# EasyEDA Pro project Adorkable_EXP.eprj, schematic Schematic1

## Sheets
1 RK809-5: Board Name: Board1; Create Date: 2024-12-09; Page Name: RK809-5; Project Name: Adorkable_EXP; Schematic Name: Schematic1; Update Date: 2024-12-10; Company: 嘉立创EDA; Page Size: A4; Version: V1.0
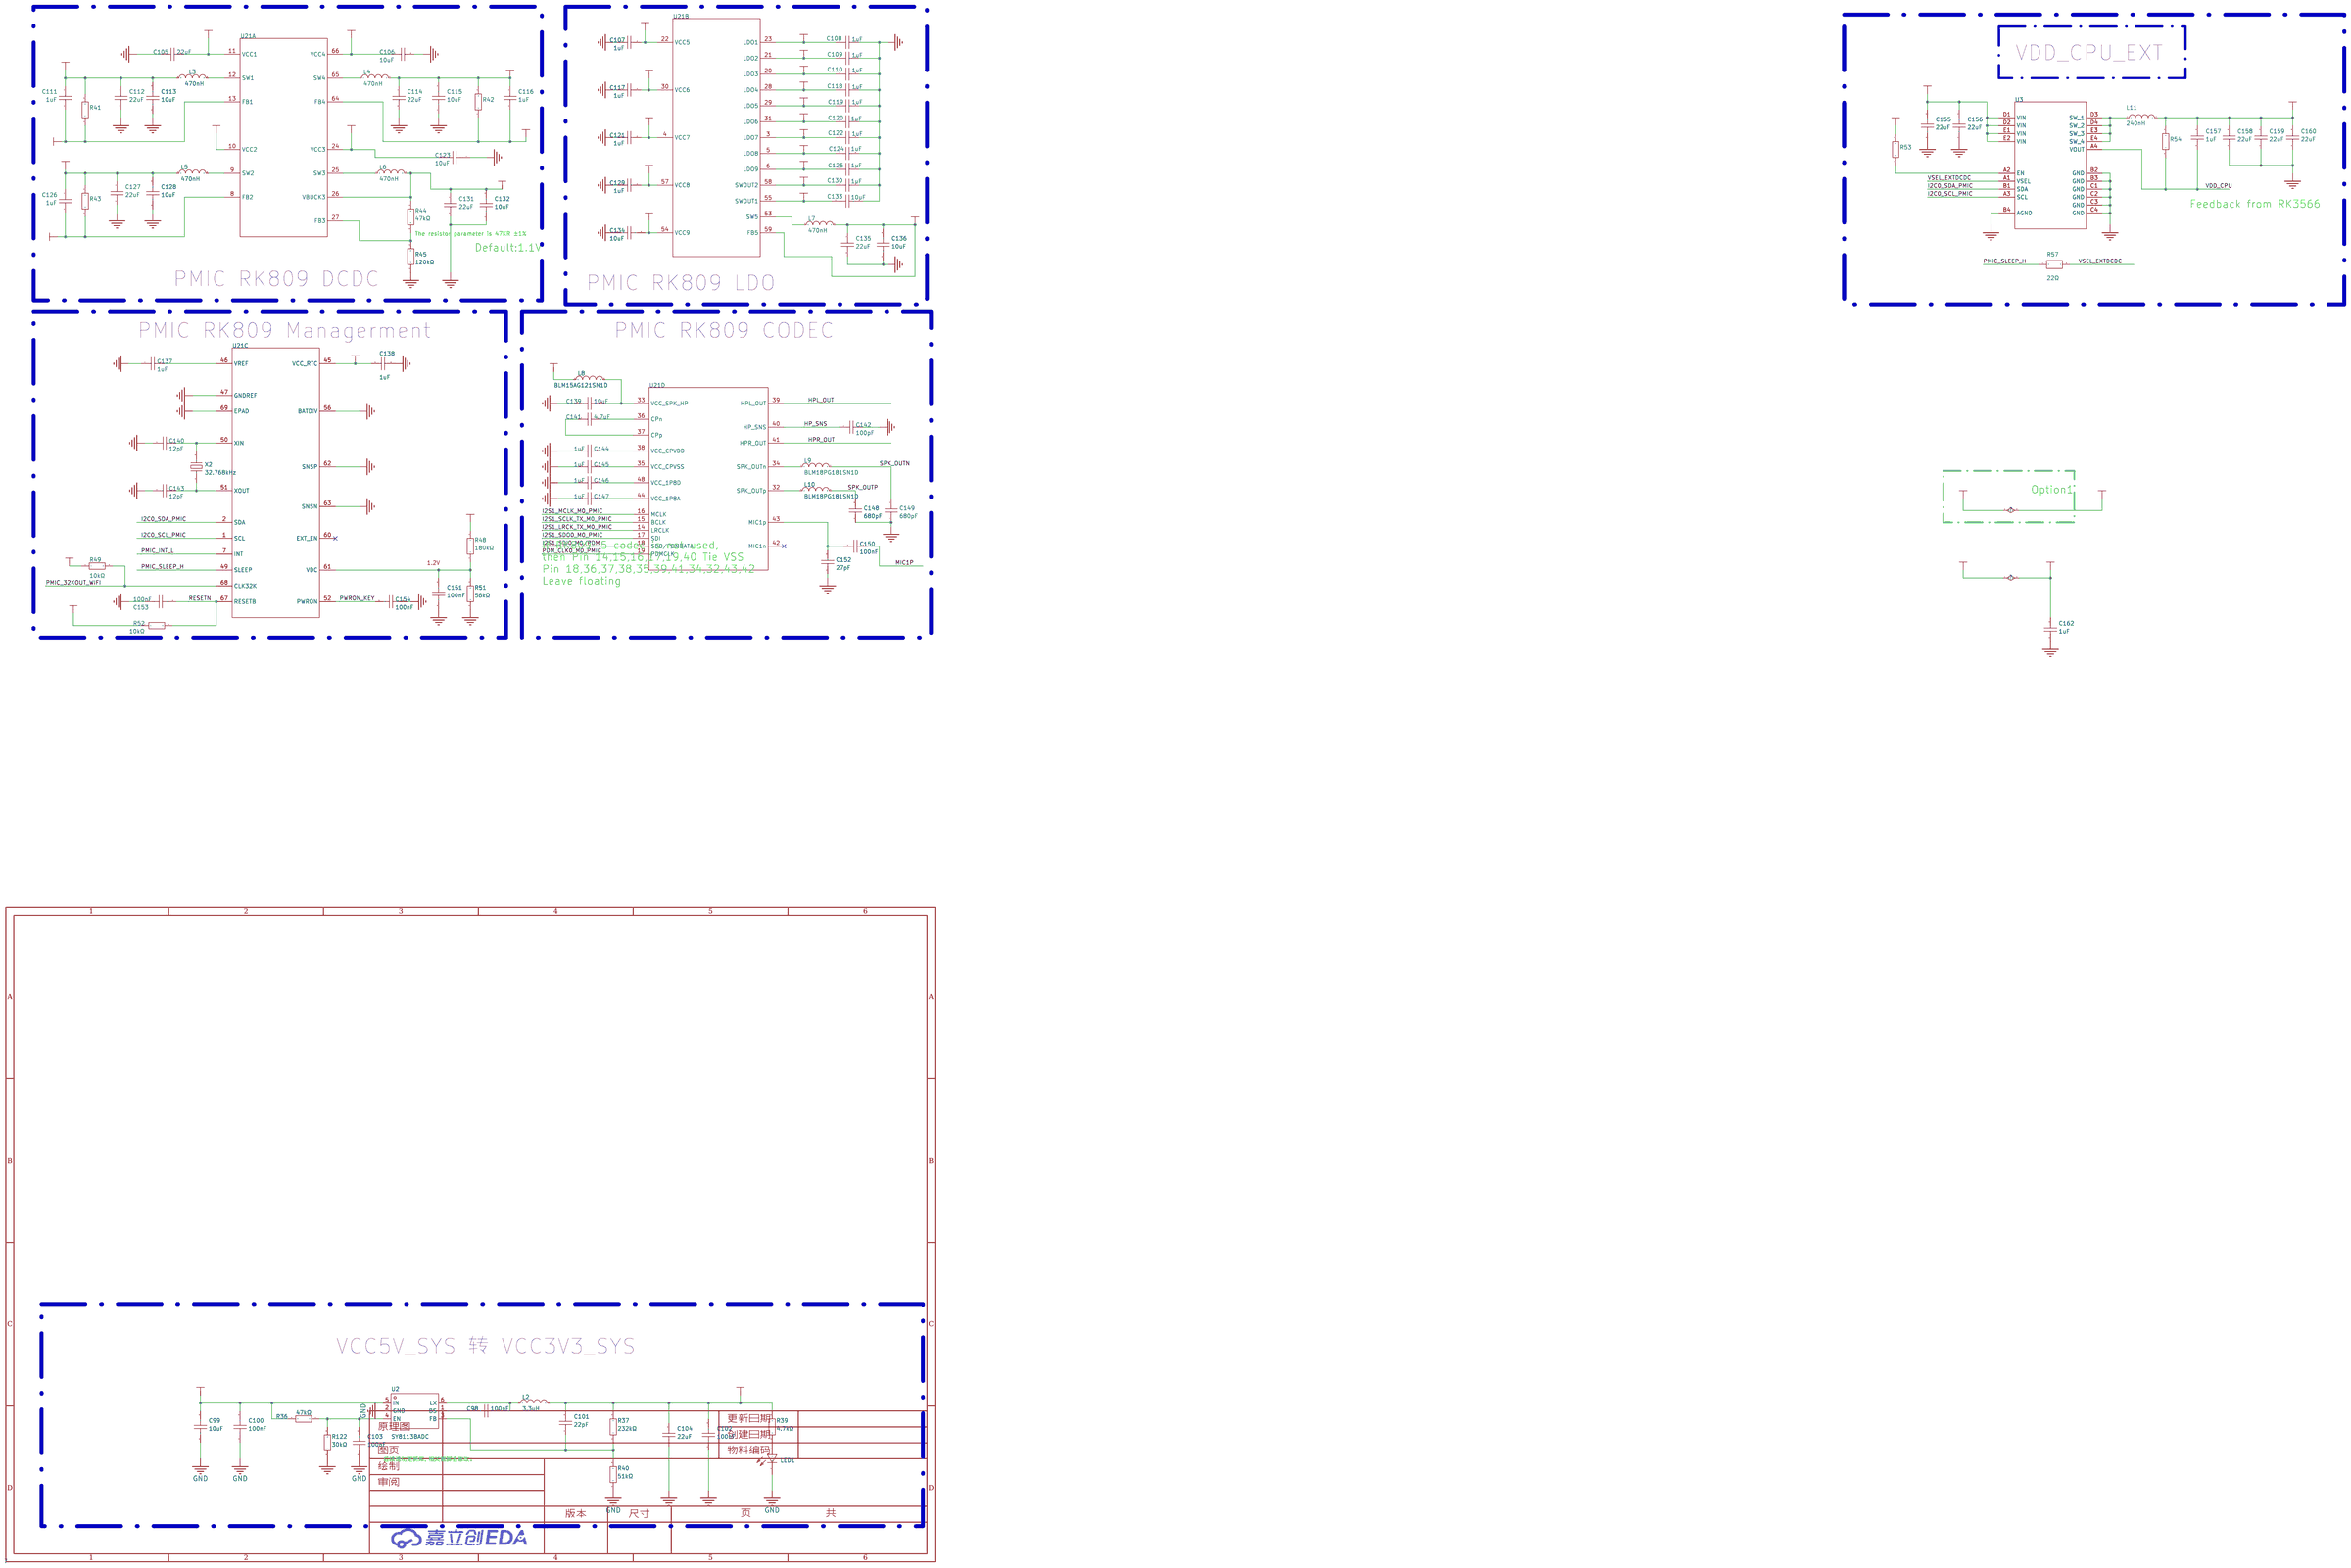
[diagram p0: RK809-5]
2 AP6212: Page Name: AP6212; Project Name: MiniTV_Plus_PWR_WiFi; Update Date: 2024-12-09
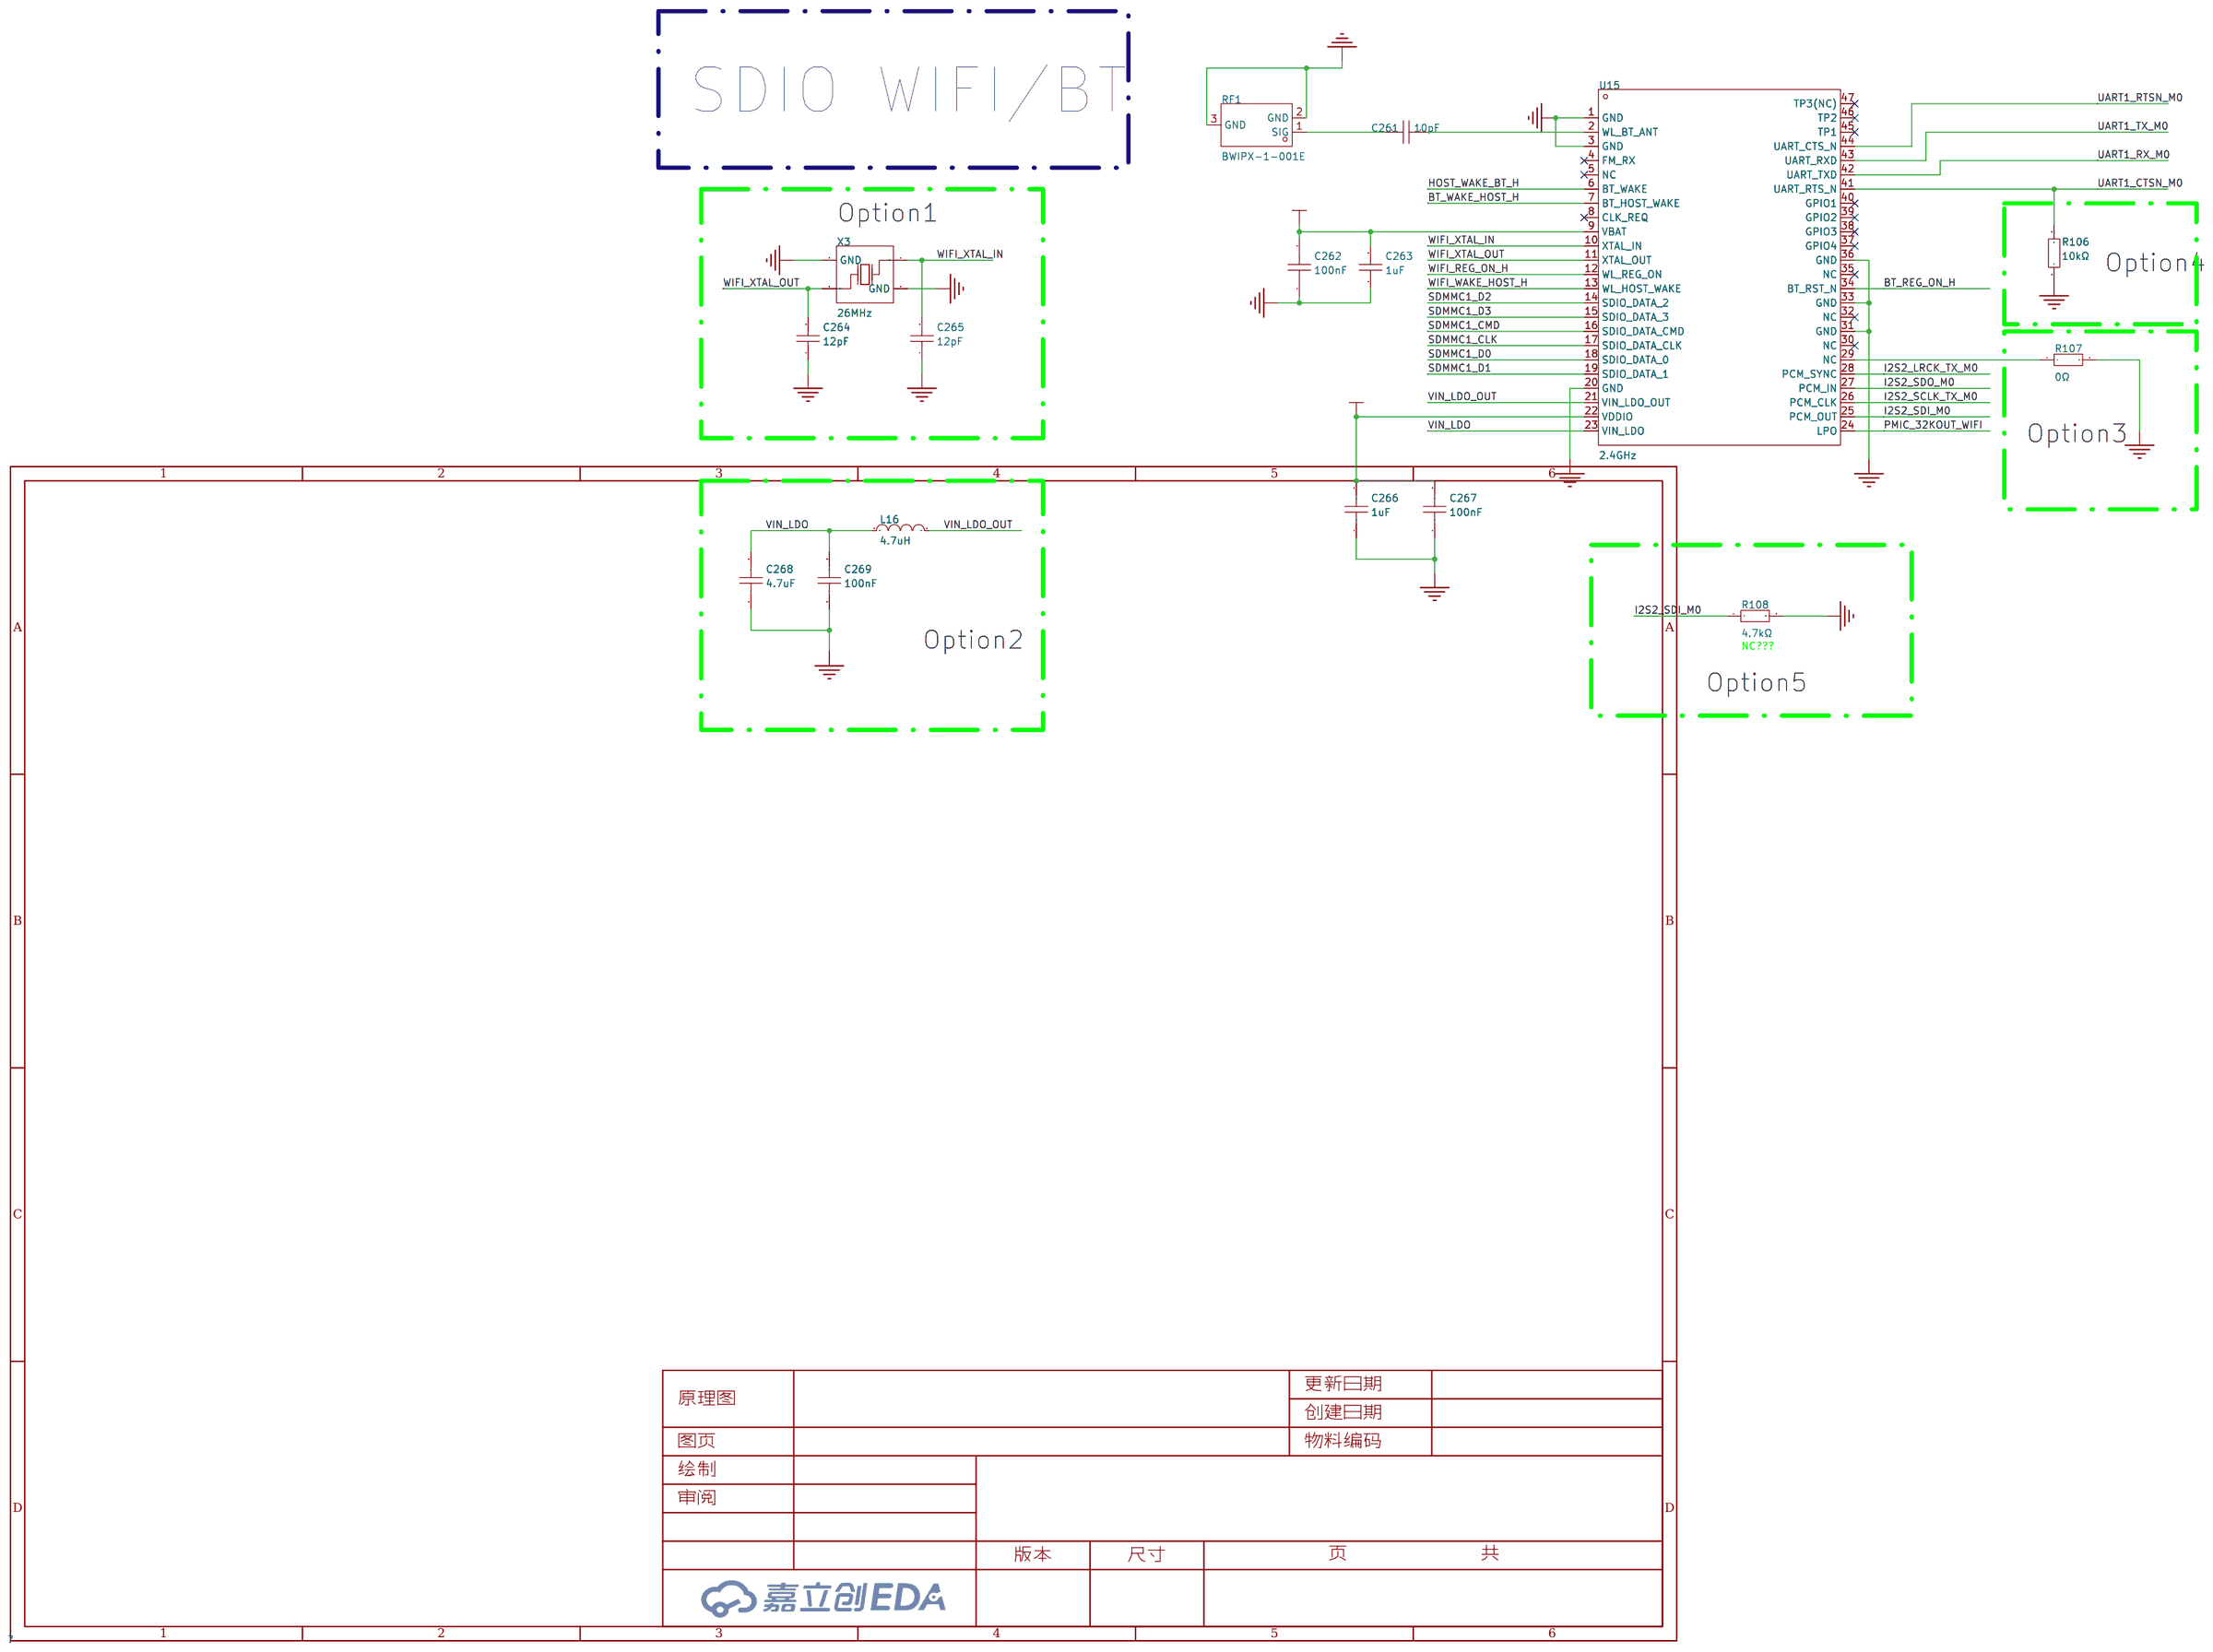
[diagram p1: AP6212]
3 EMMC: Page Name: EMMC; Project Name: MiniTV_Plus_PWR_WiFi
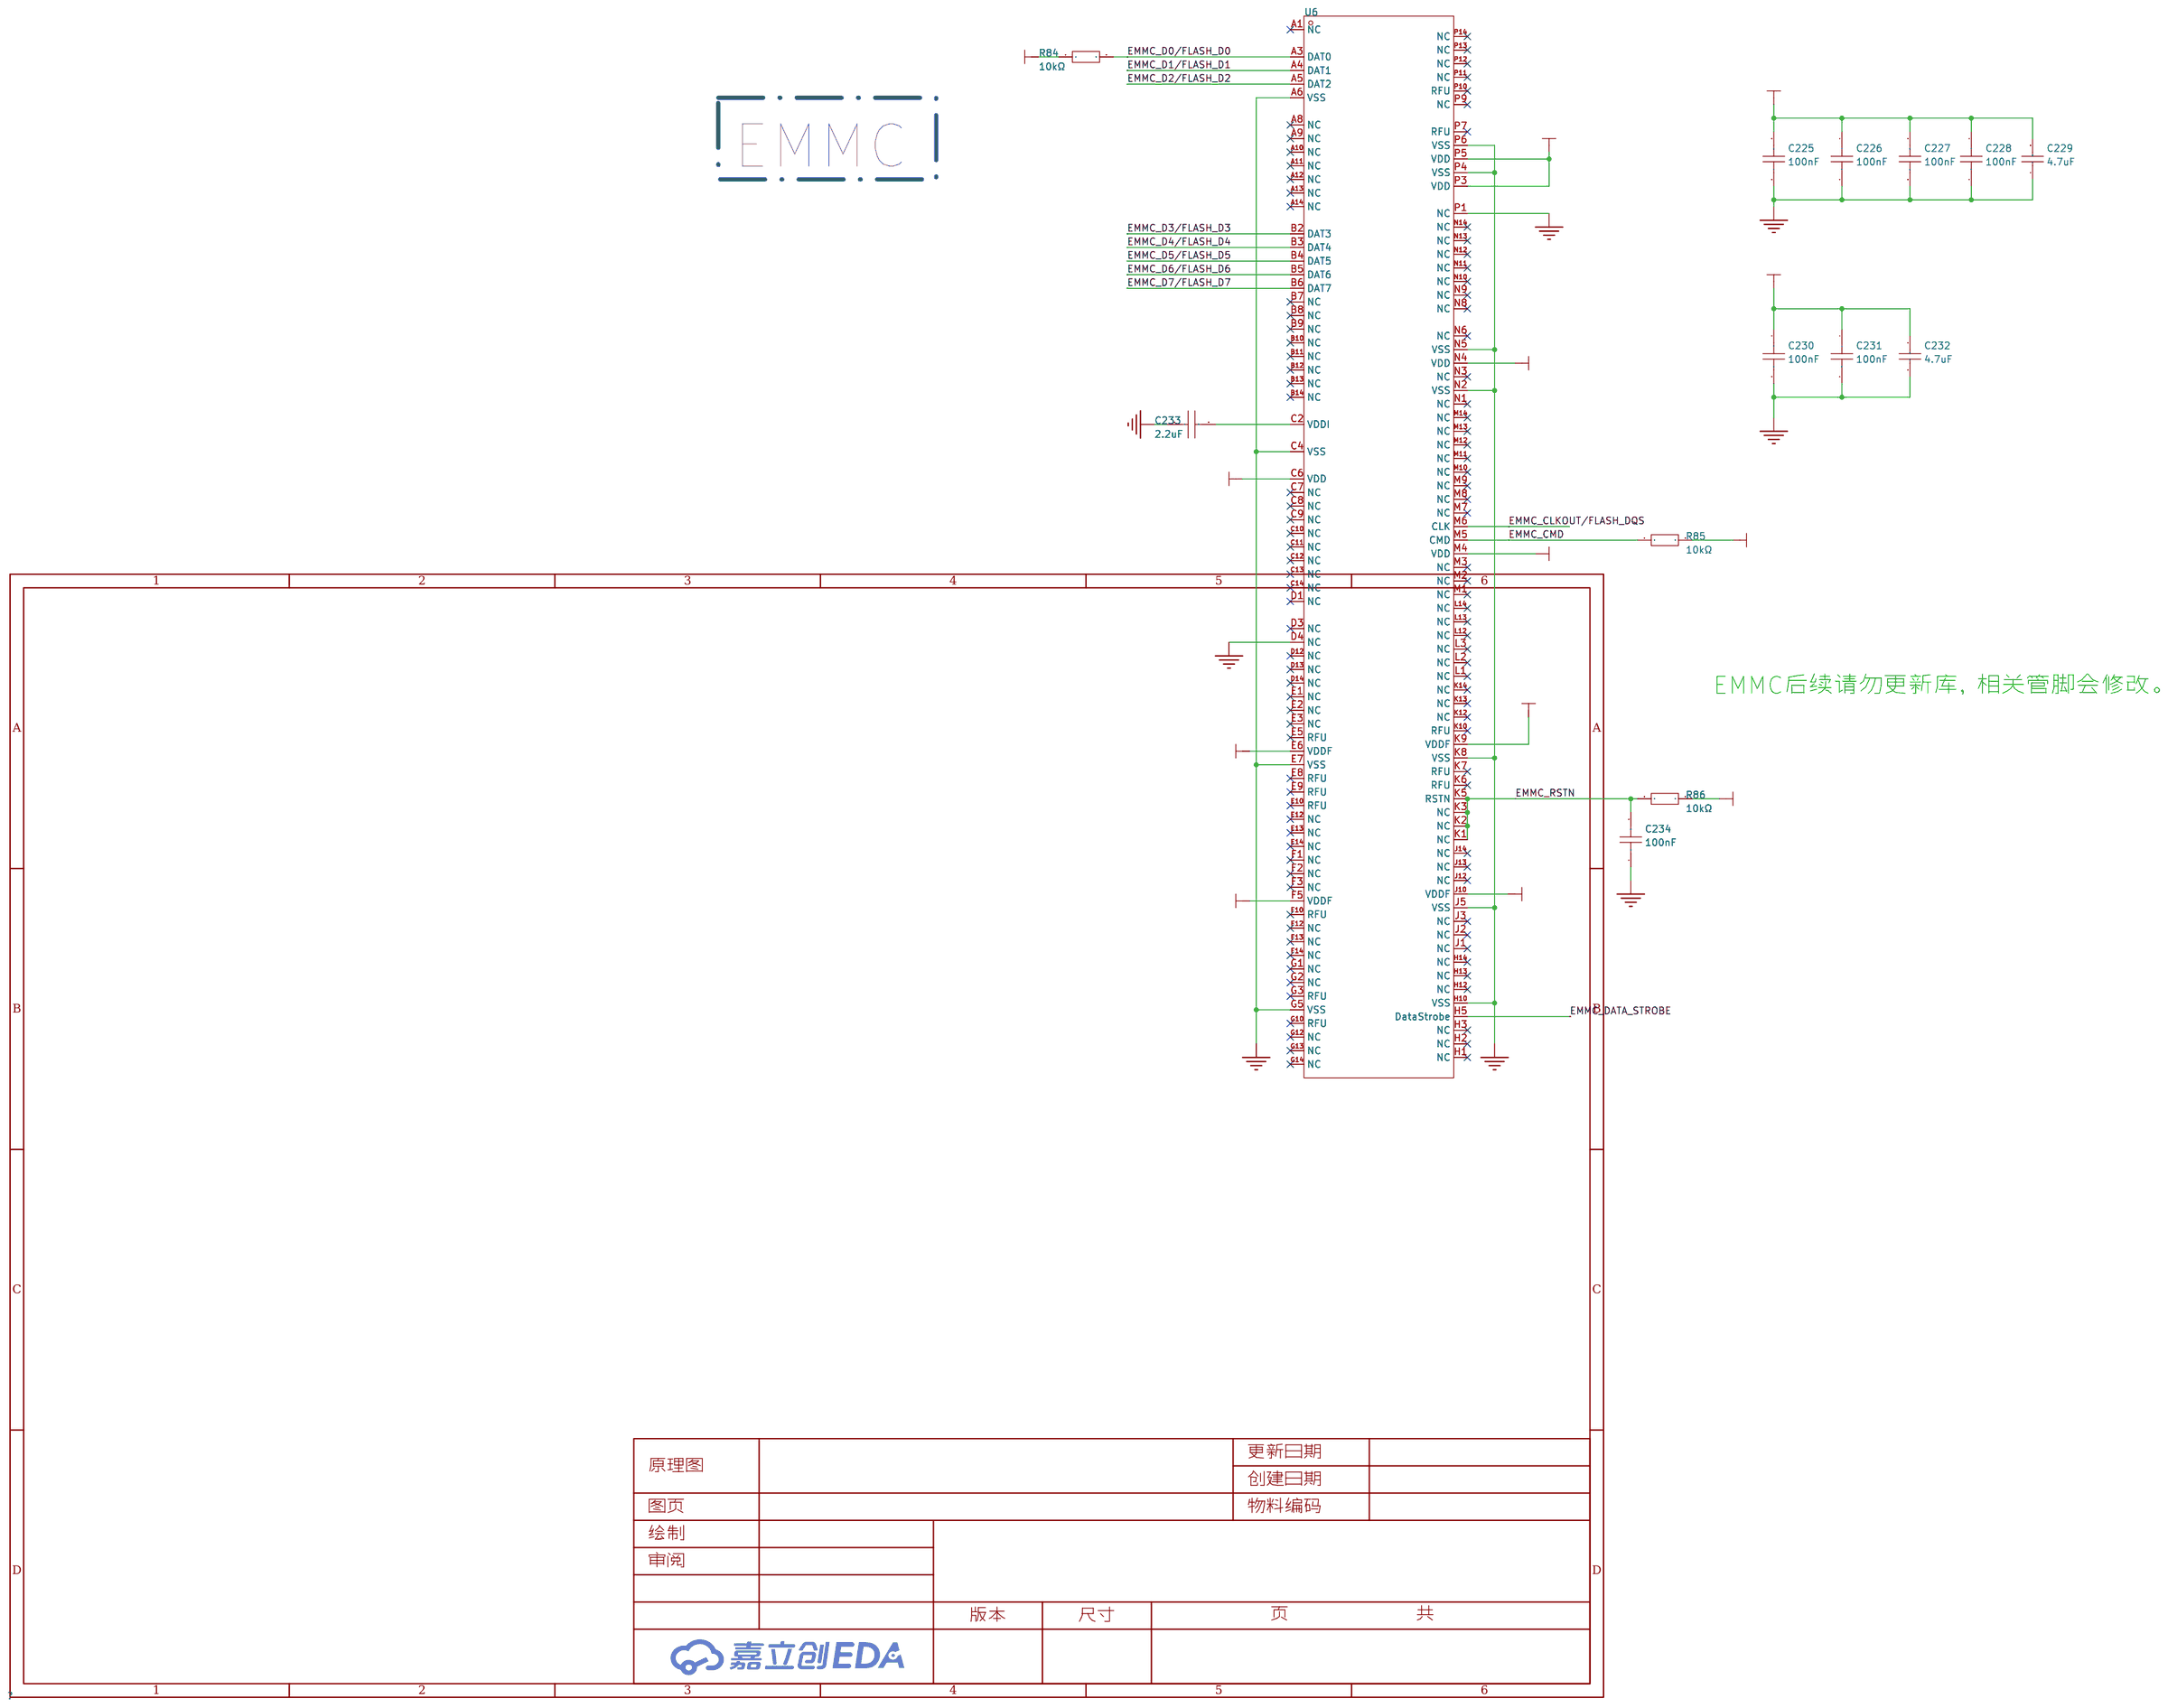
[diagram p2: EMMC]

## Parts
sheet AP6212
C261  10pF  [C0402]
C262  100nF  [R0603]
C263  1uF  [R0603]
C264  12pF  [C0603]
C265  12pF  [C0603]
C266  1uF  [R0402]
C267  100nF  [R0603]
C268  4.7uF  [R0402]
C269  100nF  [R0603]
L16  4.7uH  [L1008]
R106  10kΩ  [R0402]
R107  0Ω  [R0402]
R108  4.7kΩ  [R0402]
RF1  BWIPX-1-001E  [IPEX-SMD_BWIPX-1-001E]
U15  2.4GHz  [QFN-44_L12.0-W12.0-P0.90-TL_AP6212]
X3  26MHz  [CRYSTAL-SMD_4P-L2.0-W1.6-BL]
sheet EMMC
C225  100nF  [R0402]
C226  100nF  [R0402]
C227  100nF  [R0402]
C228  100nF  [R0402]
C229  4.7uF  [R0402]
C230  100nF  [R0402]
C231  100nF  [R0402]
C232  4.7uF  [R0402]
C233  2.2uF  [R0402]
C234  100nF  [R0402]
R84  10kΩ  [R0402]
R85  10kΩ  [R0402]
R86  10kΩ  [R0402]
U6  SDINBDG4-8G  [FBGA-153_L13.0-W11.5-P0.50_KLMAG1JETD-B041]
sheet RK809-5
C98  100nF  [R0402]
C99  10uF  [C0603]
C100  100nF  [R0603]
C101  22pF  [R0402]
C102  100nF  [R0603]
C103  100nF  [R0402]
C104  22uF  [C0603]
C105  22uF  [C0603]
C106  10uF  [R0402]
C107  1uF  [R0402]
C108  1uF  [R0402]
C109  1uF  [R0402]
C110  1uF  [R0402]
C111  1uF  [R0402]
C112  22uF  [C0603]
C113  10uF  [C0603]
C114  22uF  [C0603]
C115  10uF  [C0603]
C116  1uF  [R0402]
C117  1uF  [R0402]
C118  1uF  [R0402]
C119  1uF  [R0402]
C120  1uF  [R0402]
C121  1uF  [R0402]
C122  1uF  [R0402]
C123  10uF  [C0603]
C124  1uF  [R0402]
C125  1uF  [R0402]
C126  1uF  [R0402]
C127  22uF  [C0603]
C128  10uF  [C0603]
C129  1uF  [R0402]
C130  1uF  [R0402]
C131  22uF  [C0603]
C132  10uF  [C0603]
C133  10uF  [C0603]
C134  10uF  [C0603]
C135  22uF  [C0603]
C136  10uF  [C0603]
C137  1uF  [R0402]
C138  1uF  [R0402]
C139  10uF  [R0402]
C140  12pF  [R0402]
C141  4.7uF  [R0402]
C142  100pF  [R0402]
C143  12pF  [R0402]
C144  1uF  [R0402]
C145  1uF  [R0402]
C146  1uF  [R0402]
C147  1uF  [R0402]
C148  680pF  [R0402]
C149  680pF  [R0402]
C150  100nF  [R0402]
C151  100nF  [R0402]
C152  27pF  [R0402]
C153  100nF  [R0402]
C154  100nF  [R0402]
C155  22uF  [C0603]
C156  22uF  [C0603]
C157  1uF  [R0402]
C158  22uF  [C0603]
C159  22uF  [C0603]
C160  22uF  [C0603]
C162  1uF  [R0402]
L2  3.3uH  [IND-SMD_L4.4-W4.2]
L3  470nH  [IND-SMD_L2.0-W1.6_MHCHL201610A-1R0M-Q8A]
L4  470nH  [IND-SMD_L2.0-W1.6_MHCHL201610A-1R0M-Q8A]
L5  470nH  [IND-SMD_L2.0-W1.6_MHCHL201610A-1R0M-Q8A]
L6  470nH  [IND-SMD_L2.0-W1.6_MHCHL201610A-1R0M-Q8A]
L7  470nH  [IND-SMD_L2.0-W1.6_MHCHL201610A-1R0M-Q8A]
L8  BLM15AG121SN1D  [L0402]
L9  BLM18PG181SN1D  [L0603]
L10  BLM18PG181SN1D  [L0603]
L11  240nH  [IND-SMD_L2.5-W2.0_WPN252012H]
LED1  19-217/GHC-YR1S2/3T  [LED0603-RD]
R36  47kΩ  [R0402]
R37  232kΩ  [R0402]
R39  4.7kΩ  [R0402]
R40  51kΩ  [R0402]
R41  0402WGF1000TCE  [R0402]
R42  0402WGF1000TCE  [R0402]
R43  0402WGF1000TCE  [R0402]
R44  47kΩ  [R0402]
R45  120kΩ  [R0402]
R48  180kΩ  [R0402]
R49  10kΩ  [R0402]
R51  56kΩ  [R0402]
R52  10kΩ  [R0402]
R53  0402WGF5102TCE  [R0402]
R54  0402WGF1000TCE  [R0402]
R57  22Ω  [R0402]
R122  30kΩ  [R0402]
U2  SY8113BADC  [TSOT-23-6_L2.9-W1.6-P0.95-LS2.8-BR]
U3  -  [TCS4525]
U21  -  [RK809-5]  (sections 1,2,3,4)
X2  32.768kHz  [CRYSTAL-SMD_L3.2-W1.5-1]

## Library data of the parts
C261 = CC0402FRNPO9BN100: 容值:10pF;精度:±1%;额定电压:50V;材质(温度系数):NP0;; LCSC Part Name: 10pF ±1% 50V; Supplier Part: C513681; Manufacturer: YAGEO(国巨); Supplier Footprint: 0402; JLCPCB Part Class: Extended Part; Datasheet: https://atta.szlcsc.com/upload/public/pdf/source/20200415/C513681_5027FF1861A780E76D33CC24CC34CA99.pdf; Supplier: LCSC; Tolerance: ±1%; Voltage Rated: 50V; Temperature Coefficient: NP0
C100 C102 C262 C267 C269 = CC0603KRX7R9BB104: 容值:100nF;精度:±10%;额定电压:50V;材质(温度系数):X7R;; LCSC Part Name: 100nF ±10% 50V; Supplier Part: C14663; Manufacturer: YAGEO(国巨); Supplier Footprint: 0603; JLCPCB Part Class: Basic Part; Datasheet: https://atta.szlcsc.com/upload/public/pdf/source/20170116/1484561234239.pdf; Supplier: LCSC; Tolerance: ±10%; Voltage Rated: 50V; Temperature Coefficient: X7R
C263 = CL10A105KO8NNNC: 容值:1uF;精度:±10%;额定电压:16V;材质(温度系数):X5R;; LCSC Part Name: 1uF ±10% 16V; Supplier Part: C1592; Manufacturer: SAMSUNG(三星); Supplier Footprint: 0603; JLCPCB Part Class: Extended Part; Datasheet: https://atta.szlcsc.com/upload/public/pdf/source/20220919/9FBE606BE0D9532D730F292EB26DC5BB.pdf; Supplier: LCSC; Tolerance: ±10%; Voltage Rated: 16V; Temperature Coefficient: X5R
C264 C265 = CC0603JRNPO9BN120: 容值:12pF;精度:±5%;额定电压:50V;材质(温度系数):NP0;; LCSC Part Name: 12pF ±5% 50V; Supplier Part: C107034; Manufacturer: YAGEO(国巨); Supplier Footprint: 0603; JLCPCB Part Class: Extended Part; Datasheet: https://atta.szlcsc.com/upload/public/pdf/source/20170420/1492670686468.pdf; Supplier: LCSC; Tolerance: ±5%; Voltage Rated: 50V; Temperature Coefficient: NP0
C266 = CL05A105KA5NQNC: 容值:1uF;精度:±10%;额定电压:25V;材质(温度系数):X5R;; LCSC Part Name: 1uF ±10% 25V; Supplier Part: C52923; Manufacturer: SAMSUNG(三星); Supplier Footprint: 0402; JLCPCB Part Class: 基础库; Datasheet: https://atta.szlcsc.com/upload/public/pdf/source/20160103/1457707735223.pdf; Supplier: LCSC; Tolerance: ±10%; Voltage Rated: 25V; Temperature Coefficient: X5R
C268 = CL05A475KP5NRNC: 容值:4.7uF;精度:±10%;额定电压:10V;材质(温度系数):X5R;; LCSC Part Name: 4.7uF ±10% 10V; Supplier Part: C368809; Manufacturer: SAMSUNG(三星); Supplier Footprint: 0402; Datasheet: https://atta.szlcsc.com/upload/public/pdf/source/20190214/C368809_F5BC89A17870A6A4D09EEE17ED063906.pdf; Supplier: LCSC; Tolerance: ±10%; Voltage Rated: 10V; Temperature Coefficient: X5R
L16 = MLP2520S4R7MT0S1: 电感值:4.7uH;精度:±20%;额定电流:1A;饱和电流(Isat):-;直流电阻(DCR):130mΩ;; LCSC Part Name: 4.7uH ±20% 1A 130mΩ; Supplier Part: C91237; Manufacturer: TDK; Supplier Footprint: 1008; Datasheet: https://atta.szlcsc.com/upload/public/pdf/source/20171113/C91237_15105616670831116159.pdf; Supplier: LCSC; Tolerance: ±20%; Rated Current: 1A; DC Resistance (DCR): 130mΩ
R106 = 0402WGF1002TCE: 电阻类型:厚膜电阻;阻值:10kΩ;精度:±1%;功率:62.5mW;; LCSC Part Name: 10kΩ ±1% 62.5mW; Supplier Part: C25744; Manufacturer: UNI-ROYAL(厚声); Supplier Footprint: 0402; JLCPCB Part Class: 基础库; Datasheet: https://atta.szlcsc.com/upload/public/pdf/source/20200306/C422600_1E6D84923E4A46A82E41ADD87F860B5C.pdf; Supplier: LCSC; Type: 厚膜电阻; Tolerance: ±1%; Power(Watts): 62.5mW; Temperature Coefficient: ±100ppm/℃; Overload Voltage (Max): 50V; Operating Temperature Range: -55℃~+155℃
R107 = 0402WGF0000TCE: 电阻类型:厚膜电阻;阻值:0Ω;精度:±1%;功率:62.5mW;; LCSC Part Name: 0Ω ±1% 62.5mW; Supplier Part: C17168; Manufacturer: UNI-ROYAL(厚声); Supplier Footprint: 0402; JLCPCB Part Class: 基础库; Datasheet: https://atta.szlcsc.com/upload/public/pdf/source/20200306/C422600_1E6D84923E4A46A82E41ADD87F860B5C.pdf; Supplier: LCSC; Type: 厚膜电阻; Tolerance: ±1%; Power(Watts): 62.5mW; Temperature Coefficient: ±800ppm/℃; Overload Voltage (Max): 50V; Operating Temperature Range: -55℃~+155℃
R108 = 0402WGF4701TCE: 功率:1/16W;精度:±1%;阻值:4.7kΩ;温度系数:±100ppm/℃;最大工作电压:50V;工作温度范围:-55℃~+155℃;; LCSC Part Name: 4.7KΩ ±1%; Supplier Part: C25900; Manufacturer: UNI-ROYAL(厚声); Supplier Footprint: 0402; JLCPCB Part Class: Basic Part; Datasheet: https://atta.szlcsc.com/upload/public/pdf/source/20170920/C25900_1505895105102980906.pdf; Supplier: LCSC; Power(Watts): 1/16W; Tolerance: ±1%; Temperature Coefficient: ±100ppm/℃; Overload Voltage (Max): 50V; Operating Temperature Range: -55℃~+155℃
RF1 = BWIPX-1-001E: 连接器类型:板端;射频系列:IPEX;接口类型:内针;端口数量:1;阻抗:-;频率-最大值:-;样式:-;接口直径:-;接口长度/高度:-;工作温度范围:-;; LCSC Part Name: IPEX 内针一代板端  IPEX1座子 IPEX1 一代板端座子; Supplier Part: C496552; Manufacturer: BAT WIRELESS(蝙蝠无线); Supplier Footprint: SMD; JLCPCB Part Class: Extended Part; Datasheet: https://atta.szlcsc.com/upload/public/pdf/source/20201223/C496552_05E5A9956EAE1A8819C5051D085B1DED.pdf; Supplier: LCSC; Connector Type: 板端; RF Series: IPEX; Interface Type: 内针; Number of Ports: 1
U15 = AP6212: 频率:2.4GHz;发射功率:16dBm;核心处理器:-;天线形式:-;接收灵敏度:-90dBm;; Supplier Part: C2798300; Manufacturer: AMPAK(正基科技); Supplier Footprint: QFN-44(12x12); JLCPCB Part Class: Extended Part; Datasheet: https://atta.szlcsc.com/upload/public/pdf/source/20211112/AA78F03D5C0D0696D3667FAF5868FDF6.pdf; Supplier: LCSC; Output Power: 16dBm; Support Interface: UART; Wireless Standard: 802.11b/g/n; Sensitivity: -90dBm; Operating Temperature: -30℃~+85℃
X3 = Q22FA1280023012: 晶振类型:贴片无源晶振;频率:26MHz;频率公差:±10ppm;负载电容:10pF;等效串联电阻(ESR):60Ω;工作温度:-40℃~+85℃;; LCSC Part Name: 26MHz ±10ppm 10pF; Supplier Part: C255886; Manufacturer: EPSON(爱普生); Supplier Footprint: SMD2016-4P; JLCPCB Part Class: Extended Part; Datasheet: https://atta.szlcsc.com/upload/public/pdf/source/20180822/C255886_604316F8D006DA130C1FF16044FE8111.pdf; Supplier: LCSC; Crystal Type: 贴片无源晶振; Frequency Tolerance: ±10ppm; Load Capacitance: 10pF; Equivalent Series Resistance (ESR): 60Ω; Operating Temperature: -40℃~+85℃
C98 C103 C151 C153 C154 C225-C228 C230 C231 C234 = CL05B104KB54PNC: 容值:100nF;精度:±10%;额定电压:50V;材质(温度系数):X7R;; LCSC Part Name: 100nF ±10% 50V; Supplier Part: C307331; Manufacturer: SAMSUNG(三星); Supplier Footprint: 0402; JLCPCB Part Class: 基础库; Datasheet: https://atta.szlcsc.com/upload/public/pdf/source/20181009/C307331_222F7C870FD3EA5F46F538B483443886.pdf; Supplier: LCSC; Tolerance: ±10%; Voltage Rated: 50V; Temperature Coefficient: X7R
C229 C232 = CL05A475KP5NRNC: 容值:4.7uF;精度:±10%;额定电压:10V;材质(温度系数):X5R;; LCSC Part Name: 4.7uF ±10% 10V; Supplier Part: C368809; Manufacturer: SAMSUNG(三星); Supplier Footprint: 0402; JLCPCB Part Class: Extended Part; Datasheet: https://atta.szlcsc.com/upload/public/pdf/source/20190214/C368809_F5BC89A17870A6A4D09EEE17ED063906.pdf; Supplier: LCSC; Tolerance: ±10%; Voltage Rated: 10V; Temperature Coefficient: X5R
C233 = CL05A225MQ5NSNC: 容值:2.2uF;精度:±20%;额定电压:6.3V;材质(温度系数):X5R;; LCSC Part Name: 2.2uF ±20% 6.3V; Supplier Part: C12530; Manufacturer: SAMSUNG(三星); Supplier Footprint: 0402; JLCPCB Part Class: Basic Part; Datasheet: https://atta.szlcsc.com/upload/public/pdf/source/20160103/1457707666860.pdf; Supplier: LCSC; Tolerance: ±20%; Voltage Rated: 6.3V; Temperature Coefficient: X5R
R49 R52 R84-R86 = CRCW040210K0FKED: 电阻类型:厚膜电阻;阻值:10kΩ;精度:±1%;功率:63mW;温度系数:±100ppm/K;最大工作电压:50V;工作温度范围:-55℃~+155℃;; LCSC Part Name: 10kΩ ±1% 63mW; Supplier Part: C71617; Manufacturer: VISHAY(威世); Supplier Footprint: 0402; JLCPCB Part Class: 扩展库; Datasheet: https://atta.szlcsc.com/upload/public/pdf/source/20180224/C71617_15194370300791364062.pdf; Supplier: LCSC; Type: 厚膜电阻; Tolerance: ±1%; Power(Watts): 63mW; Temperature Coefficient: ±100ppm/K; Overload Voltage (Max): 50V; Operating Temperature Range: -55℃~+155℃
U6 = SDINBDG4-8G: 配置:-;接口类型:eMMC 5.1;顺序读/写:-;随机读/写:-;工作电压:2.7V~3.6V;工作温度:-25℃~+85℃;容量:16Gbit;; Supplier Part: C577444; Manufacturer: SANDISK(闪迪); Supplier Footprint: BGA-153; JLCPCB Part Class: Extended Part; Datasheet: https://atta.szlcsc.com/upload/public/pdf/source/20200608/C577444_ABC48B3B7720BFA2D5DD18D915AF132C.pdf; Supplier: LCSC; Interface Type: eMMC 5.1; Supply Voltage: 2.7V~3.6V; Operating Temperature: -25℃~+85℃; Density: 16Gbit; NO_CONNECT: yes
C99 C113 C115 C123 C128 C132-C134 C136 = CL10A106KP8NNNC: 容值:10uF;精度:±10%;额定电压:10V;材质(温度系数):X5R;; LCSC Part Name: 10uF ±10% 10V; Supplier Part: C19702; Manufacturer: SAMSUNG(三星); Supplier Footprint: 0603; JLCPCB Part Class: Basic Part; Datasheet: https://atta.szlcsc.com/upload/public/pdf/source/20160103/1457707703378.pdf; Supplier: LCSC; Tolerance: ±10%; Voltage Rated: 10V; Temperature Coefficient: X5R
C101 = 0402CG220J500NT: 容值:22pF;精度:±5%;额定电压:50V;材质(温度系数):C0G;; LCSC Part Name: 22pF ±5% 50V; Supplier Part: C1555; Manufacturer: FH(风华); Supplier Footprint: 0402; JLCPCB Part Class: Basic Part; Datasheet: https://atta.szlcsc.com/upload/public/pdf/source/20170923/C1555_1506149269156988362.pdf; Supplier: LCSC; Tolerance: ±5%; Voltage Rated: 50V; Temperature Coefficient: C0G
C104 C105 C112 C114 C127 C131 C135 C155 C156 C158-C160 = CL10A226MQ8NRNC: 容值:22uF;精度:±20%;额定电压:6.3V;材质(温度系数):X5R;; LCSC Part Name: 22uF ±20% 6.3V; Supplier Part: C59461; Manufacturer: SAMSUNG(三星); Supplier Footprint: 0603; JLCPCB Part Class: Basic Part; Datasheet: https://atta.szlcsc.com/upload/public/pdf/source/20160103/1457707740762.pdf; Supplier: LCSC; Tolerance: ±20%; Voltage Rated: 6.3V; Temperature Coefficient: X5R
C106 = CL05A106MQ5NUNC: 容值:10uF;精度:±20%;额定电压:6.3V;材质(温度系数):X5R;; LCSC Part Name: 10uF ±20% 6.3V; Supplier Part: C15525; Manufacturer: SAMSUNG(三星); Supplier Footprint: 0402; JLCPCB Part Class: 基础库; Datasheet: https://atta.szlcsc.com/upload/public/pdf/source/20220823/2B02EE04F8F211D38A52DCB16EB6BEBA.pdf; Supplier: LCSC; Tolerance: ±20%; Voltage Rated: 6.3V; Temperature Coefficient: X5R
C107-C111 C116-C122 C124-C126 C129 C130 C137 C138 C144-C147 C157 C162 = CL05A105KP5NNNC: 容值:1uF;精度:±10%;额定电压:10V;材质(温度系数):X5R;; LCSC Part Name: 1uF ±10% 10V; Supplier Part: C14445; Manufacturer: SAMSUNG(三星); Supplier Footprint: 0402; JLCPCB Part Class: 扩展库; Datasheet: https://atta.szlcsc.com/upload/public/pdf/source/20160103/1457707670698.pdf; Supplier: LCSC; Tolerance: ±10%; Voltage Rated: 10V; Temperature Coefficient: X5R
C139 = CL05A106MQ5NUNC: 容值:10uF;精度:±20%;额定电压:6.3V;材质(温度系数):X5R;; LCSC Part Name: 10uF ±20% 6.3V; Supplier Part: C15525; Manufacturer: SAMSUNG(三星); Supplier Footprint: 0402; JLCPCB Part Class: Basic Part; Datasheet: https://atta.szlcsc.com/upload/public/pdf/source/20220823/2B02EE04F8F211D38A52DCB16EB6BEBA.pdf; Supplier: LCSC; Tolerance: ±20%; Voltage Rated: 6.3V; Temperature Coefficient: X5R
C140 C143 = 0402CG120J500NT: 容值:12pF;精度:±5%;额定电压:50V;材质(温度系数):C0G;; LCSC Part Name: 12pF ±5% 50V; Supplier Part: C1547; Manufacturer: FH(风华); Supplier Footprint: 0402; JLCPCB Part Class: Basic Part; Datasheet: https://atta.szlcsc.com/upload/public/pdf/source/20200305/C486355_26A10D38EF8C2A5C37091D0039909270.pdf; Supplier: LCSC; Tolerance: ±5%; Voltage Rated: 50V; Temperature Coefficient: C0G
C141 = CL05A475MQ5NRNC: 容值:4.7uF;精度:±20%;额定电压:6.3V;材质(温度系数):X5R;; LCSC Part Name: 4.7uF ±20% 6.3V; Supplier Part: C307423; Manufacturer: SAMSUNG(三星); Supplier Footprint: 0402; JLCPCB Part Class: Extended Part; Datasheet: https://atta.szlcsc.com/upload/public/pdf/source/20181010/C307423_0E0C4E35F3A09F81C2E5C84E00499E42.pdf; Supplier: LCSC; Tolerance: ±20%; Voltage Rated: 6.3V; Temperature Coefficient: X5R
C142 = 0402CG101J500NT: 容值:100pF;精度:±5%;额定电压:50V;材质(温度系数):C0G;; LCSC Part Name: 100pF ±5% 50V; Supplier Part: C1546; Manufacturer: FH(风华); Supplier Footprint: 0402; JLCPCB Part Class: Basic Part; Datasheet: https://atta.szlcsc.com/upload/public/pdf/source/20170923/C1546_1506149265265988353.pdf; Supplier: LCSC; Tolerance: ±5%; Voltage Rated: 50V; Temperature Coefficient: C0G
C148 C149 = 0402B681K500NT: 容值:680pF;精度:±10%;额定电压:50V;材质(温度系数):X7R;; LCSC Part Name: 680pF ±10% 50V; Supplier Part: C1541; Manufacturer: FH(风华); Supplier Footprint: 0402; JLCPCB Part Class: Extended Part; Datasheet: https://atta.szlcsc.com/upload/public/pdf/source/20170923/C1541_1506149263051988348.pdf; Supplier: LCSC; Tolerance: ±10%; Voltage Rated: 50V; Temperature Coefficient: X7R
C150 = CL05B104KO5NNNC: 容值:100nF;精度:±10%;额定电压:16V;材质(温度系数):X7R;; LCSC Part Name: 100nF ±10% 16V; Supplier Part: C1525; Manufacturer: SAMSUNG(三星); Supplier Footprint: 0402; JLCPCB Part Class: 基础库; Datasheet: https://atta.szlcsc.com/upload/public/pdf/source/20160103/1457707674891.pdf; Supplier: LCSC; Tolerance: ±10%; Voltage Rated: 16V; Temperature Coefficient: X7R
C152 = 0402CG270J500NT: 容值:27pF;精度:±5%;额定电压:50V;材质(温度系数):C0G;; LCSC Part Name: 27pF ±5% 50V; Supplier Part: C1557; Manufacturer: FH(风华); Supplier Footprint: 0402; JLCPCB Part Class: Basic Part; Datasheet: https://atta.szlcsc.com/upload/public/pdf/source/20170923/C1557_1506149270123988364.pdf; Supplier: LCSC; Tolerance: ±5%; Voltage Rated: 50V; Temperature Coefficient: C0G
L2 = MWSA0402S-3R3MT: 额定电流:3.3A;精度:±20%;电感值:3.3uH;直流电阻(DCR):87mΩ;; LCSC Part Name: 3.3uH ±20%; Supplier Part: C408336; Manufacturer: Sunlord(顺络); Supplier Footprint: SMD; JLCPCB Part Class: Extended Part; Datasheet: https://atta.szlcsc.com/upload/public/pdf/source/20190729/C408336_17B5BB1DF2845DE8F323BD9CE9EEFEBA.pdf; Supplier: LCSC; Height: 2mm; Rated Current: 3.3A; Width: 4.4mm; Tolerance: ±20%; DC Resistance (DCR): 87mΩ; Length: 4.2mm
L3-L7 = MCS20FC-R47MHC: 电感值:470nH;精度:±20%;额定电流:4.05A;; LCSC Part Name: 470nH ±20% 4.05A 23mΩ; Supplier Part: C375941; Manufacturer: PSA(信昌电陶); Supplier Footprint: SMD; JLCPCB Part Class: 扩展库; Datasheet: https://atta.szlcsc.com/upload/public/pdf/source/20190312/C375941_0FA6931C341ECE1823B3912EFF81D587.pdf; Supplier: LCSC; Tolerance: ±20%; Rated Current: 4.05A; DC Resistance (DCR): 23mΩ
L8 = BLM15AG121SN1D: 标称阻抗@测试频率:120Ω@100MHz;误差:±25%;直流电阻(RDC):250mΩ;额定电流:500mA;电路数:1;; LCSC Part Name: 120Ω@100MHz ±25%; Supplier Part: C85812; Manufacturer: muRata(村田); Supplier Footprint: 0402; JLCPCB Part Class: Extended Part; Datasheet: https://atta.szlcsc.com/upload/public/pdf/source/20180326/C85812_709B7ABD18A92BCC8FFBD7A231EEE264.pdf; Supplier: LCSC; Impedance @ Frequency: 120Ω@100MHz; Tolerance: ±25%; DC Resistance: 250mΩ; Current Rating: 500mA; Circuits: 1
L9 L10 = BLM18PG181SN1D: 标称阻抗@测试频率:180Ω@100MHz;误差:±25%;直流电阻(RDC):90mΩ;额定电流:1.5A;电路数:1;; LCSC Part Name: 180Ω@100MHz ±25%; Supplier Part: C82850; Manufacturer: muRata(村田); Supplier Footprint: 0603; JLCPCB Part Class: Extended Part; Datasheet: https://atta.szlcsc.com/upload/public/pdf/source/20180326/C82850_BC876320DC99E3923AFD377E2F9C4AED.pdf; Supplier: LCSC; Impedance @ Frequency: 180Ω@100MHz; Tolerance: ±25%; DC Resistance: 90mΩ; Current Rating: 1.5A; Circuits: 1
L11 = WPN252012HR24MT: 电感值:240nH;精度:±20%;额定电流:4.05A;饱和电流(Isat):-;直流电阻(DCR):19mΩ;; LCSC Part Name: 240nH ±20% 4.05A 19mΩ; Supplier Part: C305274; Manufacturer: Sunlord(顺络); Supplier Footprint: SMD; JLCPCB Part Class: Extended Part; Datasheet: https://atta.szlcsc.com/upload/public/pdf/source/20210916/5D33DED32780FEB7D0AA8BED8FC93477.pdf; Supplier: LCSC; Tolerance: ±20%; Rated Current: 4.05A; DC Resistance (DCR): 19mΩ
LED1 = 19-217/GHC-YR1S2/3T: 发光颜色:翠绿;二极管配置:-;主波长:520nm~535nm;色温:-;功率:110mW;安装方式:-;; Supplier Part: C72043; Manufacturer: EVERLIGHT(亿光); Supplier Footprint: 0603; JLCPCB Part Class: Basic Part; Datasheet: https://atta.szlcsc.com/upload/public/pdf/source/20160507/1462613613780.pdf; Supplier: LCSC; Emitted Color: 翠绿; Lens Color: 无色透明; Dominant Wavelength: 520nm~535nm; Peak Wavelength: 518nm; Forward Current: 20mA; Power Dissipation: 110mW; Viewing Angle: 120°; Operating Temperature: -40℃~+85℃
R36 = 0402WGF4702TCE: 电阻类型:厚膜电阻;阻值:47kΩ;精度:±1%;功率:62.5mW;; LCSC Part Name: 47kΩ ±1% 62.5mW; Supplier Part: C25792; Manufacturer: UNI-ROYAL(厚声); Supplier Footprint: 0402; JLCPCB Part Class: Basic Part; Datasheet: https://atta.szlcsc.com/upload/public/pdf/source/20200306/C422600_1E6D84923E4A46A82E41ADD87F860B5C.pdf; Supplier: LCSC; Type: 厚膜电阻; Tolerance: ±1%; Power(Watts): 62.5mW; Temperature Coefficient: ±100ppm/℃; Overload Voltage (Max): 50V; Operating Temperature Range: -55℃~+155℃
R37 = RC0402FR-07232KL: 电阻类型:厚膜电阻;阻值:232kΩ;精度:±1%;功率:62.5mW;; LCSC Part Name: 232kΩ ±1% 62.5mW; Supplier Part: C309542; Manufacturer: YAGEO(国巨); Supplier Footprint: 0402; JLCPCB Part Class: Extended Part; Datasheet: https://atta.szlcsc.com/upload/public/pdf/source/20181009/C309542_CA3F4488430805647C87B9489F02B718.pdf; Supplier: LCSC; Type: 厚膜电阻; Tolerance: ±1%; Power(Watts): 62.5mW; Temperature Coefficient: ±100ppm/℃; Overload Voltage (Max): 50V; Operating Temperature Range: -55℃~+155℃
R39 = 0402WGF4701TCE: 电阻类型:厚膜电阻;阻值:4.7kΩ;精度:±1%;功率:62.5mW;; LCSC Part Name: 4.7kΩ ±1% 62.5mW; Supplier Part: C25900; Manufacturer: UNI-ROYAL(厚声); Supplier Footprint: 0402; JLCPCB Part Class: Basic Part; Datasheet: https://atta.szlcsc.com/upload/public/pdf/source/20200306/C422600_1E6D84923E4A46A82E41ADD87F860B5C.pdf; Supplier: LCSC; Power(Watts): 62.5mW; Tolerance: ±1%; Temperature Coefficient: ±100ppm/℃; Overload Voltage (Max): 50V; Operating Temperature Range: -55℃~+155℃; Type: 厚膜电阻
R40 = 0402WGF5102TCE: 电阻类型:厚膜电阻;阻值:51kΩ;精度:±1%;功率:62.5mW;; LCSC Part Name: 51kΩ ±1% 62.5mW; Supplier Part: C25794; Manufacturer: UNI-ROYAL(厚声); Supplier Footprint: 0402; JLCPCB Part Class: Basic Part; Datasheet: https://atta.szlcsc.com/upload/public/pdf/source/20200306/C422600_1E6D84923E4A46A82E41ADD87F860B5C.pdf; Supplier: LCSC; Type: 厚膜电阻; Tolerance: ±1%; Power(Watts): 62.5mW; Temperature Coefficient: ±100ppm/℃; Overload Voltage (Max): 50V; Operating Temperature Range: -55℃~+155℃
R41-R43 R54 = 0402WGF1000TCE: Supplier: LCSC; Supplier Part: C25076; Supplier Footprint: 0402; JLCPCB Part Class: Basic Part; LCSC Part Name: 100Ω(1000) ±1% 编带; Datasheet: https://atta.szlcsc.com/upload/public/pdf/source/20170920/C25076_1505901197574982707.pdf; Manufacturer: UNI-ROYAL(厚声)
R44 = 0402WGF4702TCE: 电阻类型:厚膜电阻;阻值:47kΩ;精度:±1%;功率:62.5mW;温度系数:±100ppm/℃;最大工作电压:50V;工作温度范围:-55℃~+155℃;; LCSC Part Name: 47kΩ ±1% 62.5mW; Supplier Part: C25792; Manufacturer: UNI-ROYAL(厚声); Supplier Footprint: 0402; JLCPCB Part Class: Basic Part; Datasheet: https://atta.szlcsc.com/upload/public/pdf/source/20200306/C422600_1E6D84923E4A46A82E41ADD87F860B5C.pdf; Supplier: LCSC; Type: 厚膜电阻; Tolerance: ±1%; Power(Watts): 62.5mW; Temperature Coefficient: ±100ppm/℃; Overload Voltage (Max): 50V; Operating Temperature Range: -55℃~+155℃
R45 = 0402WGF1203TCE: 电阻类型:厚膜电阻;阻值:120kΩ;精度:±1%;功率:62.5mW;温度系数:±100ppm/℃;最大工作电压:50V;工作温度范围:-55℃~+155℃;; LCSC Part Name: 120kΩ ±1% 62.5mW; Supplier Part: C25750; Manufacturer: UNI-ROYAL(厚声); Supplier Footprint: 0402; JLCPCB Part Class: Basic Part; Datasheet: https://atta.szlcsc.com/upload/public/pdf/source/20200306/C422600_1E6D84923E4A46A82E41ADD87F860B5C.pdf; Supplier: LCSC; Type: 厚膜电阻; Tolerance: ±1%; Power(Watts): 62.5mW; Temperature Coefficient: ±100ppm/℃; Overload Voltage (Max): 50V; Operating Temperature Range: -55℃~+155℃
R48 = RC0402FR-07180KL: 电阻类型:厚膜电阻;阻值:180kΩ;精度:±1%;功率:62.5mW;温度系数:±100ppm/℃;最大工作电压:50V;工作温度范围:-55℃~+155℃;; LCSC Part Name: 180kΩ ±1% 62.5mW; Supplier Part: C138046; Manufacturer: YAGEO(国巨); Supplier Footprint: 0402; JLCPCB Part Class: Extended Part; Datasheet: https://atta.szlcsc.com/upload/public/pdf/source/20171107/C138046_15100516638711096969.pdf; Supplier: LCSC; Type: 厚膜电阻; Tolerance: ±1%; Power(Watts): 62.5mW; Temperature Coefficient: ±100ppm/℃; Overload Voltage (Max): 50V; Operating Temperature Range: -55℃~+155℃
R51 = 0402WGF5602TCE: 精度:±1%;功率:1/16W;温度系数:±100ppm/℃;阻值:56kΩ;最大工作电压:50V;工作温度范围:-55℃~+155℃;; LCSC Part Name: 56KΩ ±1%; Supplier Part: C25796; Manufacturer: UNI-ROYAL(厚声); Supplier Footprint: 0402; JLCPCB Part Class: Basic Part; Datasheet: https://atta.szlcsc.com/upload/public/pdf/source/20170920/C25796_1505901547482983369.pdf; Supplier: LCSC; Tolerance: ±1%; Power(Watts): 1/16W; Temperature Coefficient: ±100ppm/℃; Overload Voltage (Max): 50V; Operating Temperature Range: -55℃~+155℃
R53 = 0402WGF5102TCE: LCSC Part Name: 51KΩ(5102) ±1% 编带; Supplier Part: C25794; Manufacturer: UNI-ROYAL(厚声); Supplier Footprint: 0402; JLCPCB Part Class: Basic Part; Datasheet: https://atta.szlcsc.com/upload/public/pdf/source/20170920/C25794_1505901546513983367.pdf; Supplier: LCSC
R57 = 0402WGF220JTCE: 电阻类型:厚膜电阻;阻值:22Ω;精度:±1%;功率:62.5mW;温度系数:±100ppm/℃;; LCSC Part Name: 厚膜电阻 22Ω ±1% 62.5mW; Supplier Part: C25092; Manufacturer: UNI-ROYAL(厚声); Supplier Footprint: 0402; JLCPCB Part Class: Basic Part; Datasheet: https://atta.szlcsc.com/upload/public/pdf/source/20200306/C422600_1E6D84923E4A46A82E41ADD87F860B5C.pdf; Supplier: LCSC; Type: 厚膜电阻; Tolerance: ±1%; Power(Watts): 62.5mW; Temperature Coefficient: ±100ppm/℃; Overload Voltage (Max): 50V; Operating Temperature Range: -55℃~+155℃
R122 = RC0402FR-0730KL: 电阻类型:厚膜电阻;阻值:30kΩ;精度:±1%;功率:62.5mW;; LCSC Part Name: 30kΩ ±1% 62.5mW; Supplier Part: C138008; Manufacturer: YAGEO(国巨); Supplier Footprint: 0402; JLCPCB Part Class: Extended Part; Datasheet: https://atta.szlcsc.com/upload/public/pdf/source/20171107/C138008_15100516356731096935.pdf; Supplier: LCSC; Type: 厚膜电阻; Tolerance: ±1%; Power(Watts): 62.5mW; Temperature Coefficient: ±100ppm/℃; Overload Voltage (Max): 50V; Operating Temperature Range: -55℃~+155℃
U2 = SY8113BADC: 功能类型:降压型;同步整流:-;输出通道数:-;拓扑结构:-;输入电压:-;输出电流(最大值):-;开关频率:-;; LCSC Part Name: 降压型; Supplier Part: C78989; Manufacturer: silergy(矽力杰); Supplier Footprint: TSOT-23-6; JLCPCB Part Class: Extended Part; Datasheet: https://atta.szlcsc.com/upload/public/pdf/source/20161125/1480067827505.pdf; Supplier: LCSC; Function: 降压型
U3 = TCS4525_WT: 高频，高电流同步降压DC-DC模块
U21 = RK809-5
X2 = XKXGI-SUA-32.768K: 频率:32.768kHz;频率公差:±20ppm;负载电容:12.5pF;; LCSC Part Name: 32.768kHz ±20ppm 12.5pF YST310S; Supplier Part: C5213671; Manufacturer: YXC(扬兴晶振); Supplier Footprint: SMD3215-2P; JLCPCB Part Class: Extended Part; Datasheet: https://atta.szlcsc.com/upload/public/pdf/source/20221026/C961783E7D3E186CA8CEB40DFC46D85F.pdf; Supplier: LCSC; Crystal Type: 贴片无源晶振; Frequency Tolerance: ±20ppm; Load Capacitance: 12.5pF; Operating Temperature: -40℃~+85℃; Equivalent Series Resistance (ESR): 70kΩ

## Nets
GND: C99.1 C100.1 C102.1 C103.1 C104.1 C105.1 C106.2 C107.1 C108.2 C109.2 C110.2 C112.2 C113.1 C114.2 C115.1 C117.1 C118.2 C119.2 C120.2 C121.1 C122.2 C123.1 C124.2 C125.2 C127.2 C128.1 C129.1 C130.2 C131.2 C132.1 C133.2 C134.1 C135.2 C136.1 C137.1 C138.2 C139.1 C140.1 C142.2 C143.2 C144.1 C145.1 C146.1 C147.1 C148.1 C149.1 C151.1 C152.1 C153.1 C154.2 C155.1 C156.1 C158.1 C159.1 C160.1 C162.1 C225.2 C226.2 C227.2 C228.2 C229.1 C230.2 C231.2 C232.1 C233.1 C234.1 C262.1 C263.1 C264.1 C265.1 C266.1 C267.1 C268.1 C269.1 LED1.1(C) R40.1 R45.1 R51.1 R106.1 R107.2 R108.2 R122.1 RF1.2(GND) RF1.3(GND) U2.2(GND) U3.B2(GND) U3.B3(GND) U3.B4(AGND) U3.C1(GND) U3.C2(GND) U3.C3(GND) U3.C4(GND) U6.A6(VSS) U6.C4(VSS) U6.D4(NC) U6.E7(VSS) U6.G5(VSS) U6.H10(VSS) U6.J5(VSS) U6.K8(VSS) U6.N2(VSS) U6.N5(VSS) U6.P1(NC) U6.P4(VSS) U6.P6(VSS) U15.1(GND) U15.3(GND) U15.20(GND) U15.31(GND) U15.33(GND) U15.36(GND) U21.47(GNDREF) U21.56(BATDIV) U21.62(SNSP) U21.63(SNSN) U21.69(EPAD) X3.2(GND) X3.4(GND)
VCC3V3_PMU: C120.1 R52.1 R53.2 U21.31(LDO6)
VCC3V3_SD: C130.1 U21.58(SWOUT2)
VCC3V3_SYS: C101.2 C102.2 C104.2 C105.2 C106.1 C107.2 C117.2 C121.2 C123.2 C129.2 C134.2 C138.1 C262.2 C263.2 L2.2 R37.2 R39.2 U15.9(VBAT) U21.4(VCC7) U21.10(VCC2) U21.11(VCC1) U21.22(VCC5) U21.24(VCC3) U21.30(VCC6) U21.45(VCC_RTC) U21.54(VCC9) U21.57(VCC8) U21.66(VCC4)
VCC5V0_SYS: C99.2 C100.2 C155.2 C156.2 L8.1 R36.2 R48.2 U2.5(IN) U3.D1(VIN) U3.D2(VIN) U3.E1(VIN) U3.E2(VIN)
VCC_3V3: C133.1 C230.1 C231.1 C232.2 U6.E6(VDDF) U6.F5(VDDF) U6.J10(VDDF) U6.K9(VDDF) U21.55(SWOUT1)
VCC_DDR: C131.1 C132.2 L6.2 R44.1 U21.26(VBUCK3)
VCCA1V8_IMAGE: C125.1 U21.6(LDO9)
VCCA1V8_PMU: C124.1 U21.5(LDO8)
VCCA_1V8: C122.1 U21.3(LDO7)
VCCIO_ACODEC: C118.1 U21.28(LDO4)
VCCIO_FLASH: C135.1 C136.2 C162.2 C225.1 C226.1 C227.1 C228.1 C229.2 C266.2 C267.2 L7.2 R49.1 R84.1 R85.2 R86.2 U6.C6(VDD) U6.M4(VDD) U6.N4(VDD) U6.P3(VDD) U6.P5(VDD) U15.22(VDDIO) U21.59(FB5)
VCCIO_SD: C119.1 U21.29(LDO5)
VDD_CPU: C157.1 C157.2 C158.2 C159.2 C160.2 L11.2 R54.1 R54.2 U3.A4(VOUT)
VDD_GPU: C126.1 C126.2 C127.1 C128.2 L5.1 R43.1 R43.2 U21.8(FB2)
VDD_LOGIC: C111.1 C111.2 C112.1 C113.2 L3.1 R41.1 R41.2 U21.13(FB1)
VDD_NPU: C114.1 C115.2 C116.1 C116.2 L4.2 R42.1 R42.2 U21.64(FB4)
VDDA0V9_IMAGE: C108.1 U21.23(LDO1)
VDDA0V9_PMU: C110.1 U21.20(LDO3)
VDDA_0V9: C109.1 U21.21(LDO2)
VIN_LDO: C268.2 C269.2 L16.1 U15.23(VIN_LDO)
VIN_LDO_OUT: L16.2 U15.21(VIN_LDO_OUT)
BT_REG_ON_H: U15.34(BT_RST_N)
BT_WAKE_HOST_H: U15.7(BT_HOST_WAKE)
EMMC_CLKOUT/FLASH_DQS: U6.M6(CLK)
EMMC_CMD: R85.1 U6.M5(CMD)
EMMC_D0/FLASH_D0: R84.2 U6.A3(DAT0)
EMMC_D1/FLASH_D1: U6.A4(DAT1)
EMMC_D2/FLASH_D2: U6.A5(DAT2)
EMMC_D3/FLASH_D3: U6.B2(DAT3)
EMMC_D4/FLASH_D4: U6.B3(DAT4)
EMMC_D5/FLASH_D5: U6.B4(DAT5)
EMMC_D6/FLASH_D6: U6.B5(DAT6)
EMMC_D7/FLASH_D7: U6.B6(DAT7)
EMMC_DATA_STROBE: U6.H5(DataStrobe)
EMMC_RSTN: C234.2 R86.1 U6.K1(NC) U6.K2(NC) U6.K3(NC) U6.K5(RSTN)
HOST_WAKE_BT_H: U15.6(BT_WAKE)
HP_SNS: C142.1 U21.40(HP_SNS)
HPL_OUT: U21.39(HPL_OUT)
HPR_OUT: U21.41(HPR_OUT)
I2C0_SCL_PMIC: U3.A3(SCL) U21.1(SCL)
I2C0_SDA_PMIC: U3.B1(SDA) U21.2(SDA)
I2S1_LRCK_TX_M0_PMIC: U21.14(LRCLK)
I2S1_MCLK_M0_PMIC: U21.16(MCLK)
I2S1_SCLK_TX_M0_PMIC: U21.15(BCLK)
I2S1_SDI0_M0/PDM: U21.18(SDO/PDMDATA)
I2S1_SDO0_M0_PMIC: U21.17(SDI)
I2S2_LRCK_TX_M0: U15.28(PCM_SYNC)
I2S2_SCLK_TX_M0: U15.26(PCM_CLK)
I2S2_SDI_M0: R108.1 U15.25(PCM_OUT)
I2S2_SDO_M0: U15.27(PCM_IN)
MIC1P: C150.2
PDM_CLK0_M0_PMIC: U21.19(PDMCLK)
PMIC_32KOUT_WIFI: R49.2 U15.24(LPO) U21.68(CLK32K)
PMIC_INT_L: U21.7(INT)
PMIC_SLEEP_H: R57.1 U21.49(SLEEP)
PWRON_KEY: C154.1 U21.52(PWRON)
RESETN: C153.2 R52.2 U21.67(RESETB)
SDMMC1_CLK: U15.17(SDIO_DATA_CLK)
SDMMC1_CMD: U15.16(SDIO_DATA_CMD)
SDMMC1_D0: U15.18(SDIO_DATA_0)
SDMMC1_D1: U15.19(SDIO_DATA_1)
SDMMC1_D2: U15.14(SDIO_DATA_2)
SDMMC1_D3: U15.15(SDIO_DATA_3)
SPK_OUTN: C149.2 L9.2
SPK_OUTP: C148.2 L10.2
UART1_CTSN_M0: R106.2 U15.41(UART_RTS_N)
UART1_RTSN_M0: U15.44(UART_CTS_N)
UART1_RX_M0: U15.42(UART_TXD)
UART1_TX_M0: U15.43(UART_RXD)
VSEL_EXTDCDC: R57.2 U3.A1(VSEL)
WIFI_REG_ON_H: U15.12(WL_REG_ON)
WIFI_WAKE_HOST_H: U15.13(WL_HOST_WAKE)
WIFI_XTAL_IN: C265.2 U15.10(XTAL_IN) X3.1(OSC1)
WIFI_XTAL_OUT: C264.2 U15.11(XTAL_OUT) X3.3(OSC2)
$C98_1: C98.1 L2.1 U2.6(LX)
$C98_2: C98.2 U2.1(BS)
$C101_1: C101.1 R37.1 R40.2 U2.3(FB)
$C103_2: C103.2 R36.1 R122.2 U2.4(EN)
$C137_2: C137.2 U21.46(VREF)
$C139_2: C139.2 L8.2 U21.33(VCC_SPK_HP)
$C140_2: C140.2 U21.50(XIN) X2.2
$C141_1: C141.1 U21.36(CPn)
$C141_2: C141.2 U21.37(CPp)
$C143_1: C143.1 U21.51(XOUT) X2.1
$C144_2: C144.2 U21.38(VCC_CPVDD)
$C145_2: C145.2 U21.35(VCC_CPVSS)
$C146_2: C146.2 U21.48(VCC_1P8D)
$C147_2: C147.2 U21.44(VCC_1P8A)
$C150_1: C150.1 C152.2 U21.43(MIC1p)
$C151_2: C151.2 R48.1 R51.2 U21.61(VDC)
$C233_2: C233.2 U6.C2(VDDI)
$C261_1: C261.1 RF1.1(SIG)
$C261_2: C261.2 U15.2(WL_BT_ANT)
$L3_2: L3.2 U21.12(SW1)
$L4_1: L4.1 U21.65(SW4)
$L5_2: L5.2 U21.9(SW2)
$L6_1: L6.1 U21.25(SW3)
$L7_1: L7.1 U21.53(SW5)
$L9_1: L9.1 U21.34(SPK_OUTn)
$L10_1: L10.1 U21.32(SPK_OUTp)
$L11_1: L11.1 U3.D3(SW_1) U3.D4(SW_2) U3.E3(SW_3) U3.E4(SW_4)
$LED1_2: LED1.2(A) R39.1
$R44_2: R44.2 R45.2 U21.27(FB3)
$R53_1: R53.1 U3.A2(EN)
$R107_1: R107.1 U15.29(NC)

Not connected (* = marked no-connect by the designer): U6 A1(NC)* A8(NC)* A9(NC)* A10(NC)* A11(NC)* A12(NC)* A13(NC)* A14(NC)* B7(NC)* B8(NC)* B9(NC)* B10(NC)* B11(NC)* B12(NC)* B13(NC)* B14(NC)* C7(NC)* C8(NC)* C9(NC)* C10(NC)* C11(NC)* C12(NC)* C13(NC)* C14(NC)* D1(NC)* D3(NC)* D12(NC)* D13(NC)* D14(NC)* E1(NC)* E2(NC)* E3(NC)* E5(RFU)* E8(RFU)* E9(RFU)* E10(RFU)* E12(NC)* E13(NC)* E14(NC)* F1(NC)* F2(NC)* F3(NC)* F10(RFU)* F12(NC)* F13(NC)* F14(NC)* G1(NC)* G2(NC)* G3(RFU)* G10(RFU)* G12(NC)* G13(NC)* G14(NC)* H1(NC)* H2(NC)* H3(NC)* H12(NC)* H13(NC)* H14(NC)* J1(NC)* J2(NC)* J3(NC)* J12(NC)* J13(NC)* J14(NC)* K6(RFU)* K7(RFU)* K10(RFU)* K12(NC)* K13(NC)* K14(NC)* L1(NC)* L2(NC)* L3(NC)* L12(NC)* L13(NC)* L14(NC)* M1(NC)* M2(NC)* M3(NC)* M7(NC)* M8(NC)* M9(NC)* M10(NC)* M11(NC)* M12(NC)* M13(NC)* M14(NC)* N1(NC)* N3(NC)* N6(NC)* N8(NC)* N9(NC)* N10(NC)* N11(NC)* N12(NC)* N13(NC)* N14(NC)* P7(RFU)* P9(NC)* P10(RFU)* P11(NC)* P12(NC)* P13(NC)* P14(NC)*; U15 4(FM_RX)* 5(NC)* 8(CLK_REQ)* 30(NC)* 32(NC)* 35(NC)* 37(GPIO4)* 38(GPIO3)* 39(GPIO2)* 40(GPIO1)* 45(TP1)* 46(TP2)* 47(TP3(NC))*; U21 42(MIC1n)* 60(EXT_EN)*

## Notes on the sheets
sheet 1
- VDD_CPU_EXT
- Feedback from RK3566
- The resistor parameter is 47KR ±1%
- Default:1.1V
- PMIC RK809 DCDC
- PMIC RK809 LDO
- PMIC RK809 Managerment
- PMIC RK809 CODEC
- Option1
- 1.2V
- If RK809-5 codec is not used,
  then Pin 14,15,16,17,19,40 Tie VSS
  Pin 18,36,37,38,35,39,41,34,32,43,42
  Leave floating
- VCC5V_SYS 转 VCC3V3_SYS
- 后续请勿更新库，相关管脚会修改。
sheet 2
- SDIO WIFI/BT
- Option1
- Option4
- Option3
- Option2
- NC???
- Option5
sheet 3
- EMMC
- EMMC后续请勿更新库，相关管脚会修改。
